# EAGLE design LCD_TFT-Xplained_V1 (EAGLE 9.6.2)
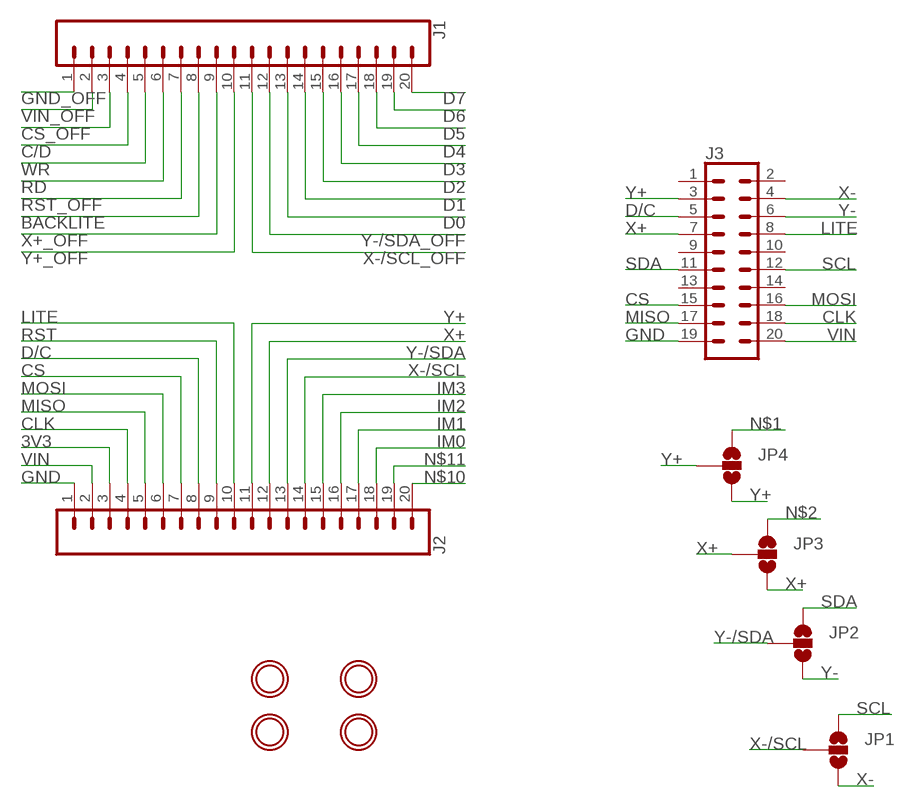
[diagram p0: schematic, sheet 1]

## Parts
J1  CONN_20NOSILK  [1X20_NOSILK]
J2  CONN_20NOSILK  [1X20_NOSILK]
J3  CONN_10X2  [2X10]
JP1  JUMPER-SMT_3_NO_NO-SILK  [SMT-JUMPER_3_NO_NO-SILK]
JP2  JUMPER-SMT_3_NO_NO-SILK  [SMT-JUMPER_3_NO_NO-SILK]
JP3  JUMPER-SMT_3_NO_NO-SILK  [SMT-JUMPER_3_NO_NO-SILK]
JP4  JUMPER-SMT_3_NO_NO-SILK  [SMT-JUMPER_3_NO_NO-SILK]
U$1  MOUNTINGHOLE3.0THIN  [MOUNTINGHOLE_3.0_PLATEDTHIN]
U$2  MOUNTINGHOLE3.0THIN  [MOUNTINGHOLE_3.0_PLATEDTHIN]
U$3  MOUNTINGHOLE3.0THIN  [MOUNTINGHOLE_3.0_PLATEDTHIN]
U$4  MOUNTINGHOLE3.0THIN  [MOUNTINGHOLE_3.0_PLATEDTHIN]

## Nets
3V3: J2.3
BACKLITE: J1.8
C/D: J1.4
CLK: J2.4 J3.18
CS: J2.7 J3.15
CS_OFF: J1.3
D0: J1.13
D1: J1.14
D2: J1.15
D3: J1.16
D4: J1.17
D5: J1.18
D6: J1.19
D7: J1.20
D/C: J2.8 J3.5
GND: J2.1 J3.19
GND_OFF: J1.1
IM0: J2.18
IM1: J2.17
IM2: J2.16
IM3: J2.15
LITE: J2.10 J3.8
MISO: J2.5 J3.17
MOSI: J2.6 J3.16
N$1: JP4.1
N$2: JP3.1
N$10: J2.20
N$11: J2.19
RD: J1.6
RST: J2.9
RST_OFF: J1.7
SCL: J3.12 JP1.1
SDA: J3.11 JP2.1
VIN: J2.2 J3.20
VIN_OFF: J1.2
WR: J1.5
X+: J2.12 J3.7 JP3.2 JP3.3
X+_OFF: J1.9
X-: J3.4 JP1.3
X-/SCL: J2.14 JP1.2
X-/SCL_OFF: J1.11
Y+: J2.11 J3.3 JP4.2 JP4.3
Y+_OFF: J1.10
Y-: J3.6 JP2.3
Y-/SDA: J2.13 JP2.2
Y-/SDA_OFF: J1.12
Unconnected: J3.1 J3.2 J3.9 J3.10 J3.13 J3.14

## Library data of the parts
J1 J2 = SparkFun-Connectors:CONN_20: Multi connection point. Often used as Generic Header-pin footprint for 0.1 inch spaced/style header connections On any of the 0.1 inch spaced packages, you can populate with these: Break Away Headers - Straight <https://www.sparkfun.com/products/116> (PRT-00116) Break Away Male Headers - Right Angle <https://www.sparkfun.com/products/553> (PRT-00553) Female Headers <https://www.sparkfun.com/products/115> (PRT-00115) Break Away Headers - Machine Pin <https://www.sparkfun.com/products/117> (PRT-00117) Break Away Female Headers - Swiss Machine Pin <https://www.sparkfun.com/products/743> (PRT-00743) For SCREWTERMINALS and SPRING TERMINALS visit here: Screw Terimnals on SparkFun.com <https://www.sparkfun.com/search/results?term=Screw+Terminals> (5mm/3.5mm/2.54mm spacing) This device is also useful as a general connection point to wire up your design to another part of your project. Our various solder wires solder well into these plated through hole pads. Hook-Up Wire - Assortment (Stranded, 22 AWG) <https://www.sparkfun.com/products/11375> (PRT-11375) Hook-Up Wire - Assortment (Solid Core, 22 AWG) <https://www.sparkfun.com/products/11367> (PRT-11367) View the entire wire category on our website here <https://www.sparkfun.com/categories/141> Special notes: Molex polarized connector foot print use with SKU : PRT-08231 with associated crimp pins and housings. 1MM SMD Version SKU: PRT-10208 NOTES ON THE VARIANTS LOCK and LOCK_LONGPADS... This footprint was designed to help hold the alignment of a through-hole component (i.e. 6-pin header) while soldering it into place. You may notice that each hole has been shifted either up or down by 0.005 of an inch from it's more standard position (which is a perfectly straight line). This slight alteration caused the pins (the squares in the middle) to touch the edges of the holes. Because they are alternating, it causes a "brace" to hold the component in place. 0.005 has proven to be the perfect amount of "off-center" position when using our standard breakaway headers. Although looks a little odd when you look at the bare footprint, once you have a header in there, the alteration is very hard to notice. Also,if you push a header all the way into place, it is covered up entirely on the bottom side. Note about LOCK SPECIAL package: This is just like the LOCK variant in that the holes are staggared by 5 mil, but except for the last two holes. They are not altered from the "standard" footprint layout. This is used for a special purpose on the layout of our Graphic LCD Backpack. Make sure you want to use this device before selecting it for you project!
J3 = SparkFun-Connectors:CONN_10X2: Multi connection point. Often used as Generic Header-pin footprint for 0.1 inch spaced/style header connections On any of the 0.1 inch spaced packages, you can populate with these: Break Away Headers - Straight <https://www.sparkfun.com/products/116> (PRT-00116) Break Away Male Headers - Right Angle <https://www.sparkfun.com/products/553> (PRT-00553) Female Headers <https://www.sparkfun.com/products/115> (PRT-00115) Break Away Headers - Machine Pin <https://www.sparkfun.com/products/117> (PRT-00117) Break Away Female Headers - Swiss Machine Pin <https://www.sparkfun.com/products/743> (PRT-00743) Special note about the "SPECIAL" package: This was SPECIALLY designed to be used with our Graphic LCD Backpack. Be sure you want to use this! It is not only staggered on each line of header holes, but IT IS ALSO offset of the center point of the top and bottom lines by 5 mil. This causes the headers to lock into place on the "standard" footprint on the LCD screen. The extra squares on the tdocu layer are there simply to reference other pins (if you were to actually populate a longer header than ten long - this is what we do with the backpacks).
JP1-JP4 = SparkFun-Jumpers:JUMPER-SMT_3_NO: Normally open jumper This jumper has three pads in close proximity to each other. Apply solder to close the connection(s).
U$1-U$4 = microbuilder:MOUNTINGHOLE: Mounting Hole For #2 screws (0.086"/2.18mm width, 0.094"/2.4mm hole) use 2.5mm; BOM: EXCLUDE

## Net classes
0 default: width 0.508 mm, drill 0.457 mm, clearance 0.178 mm

## Board
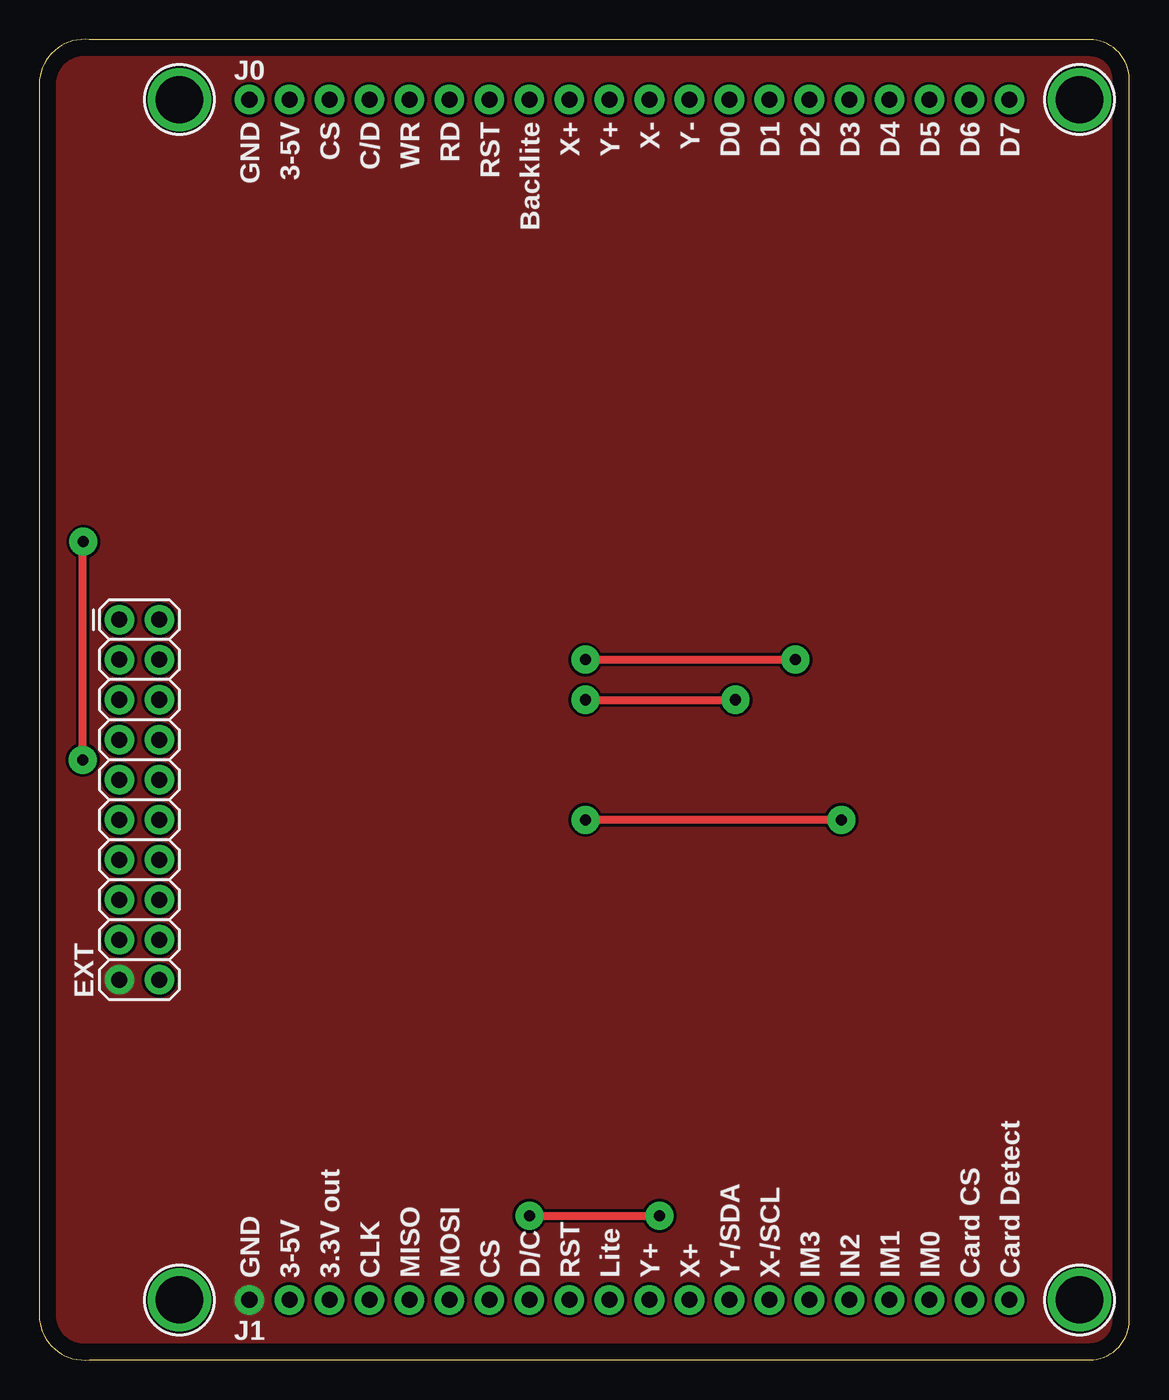
[diagram p1: board, top side]
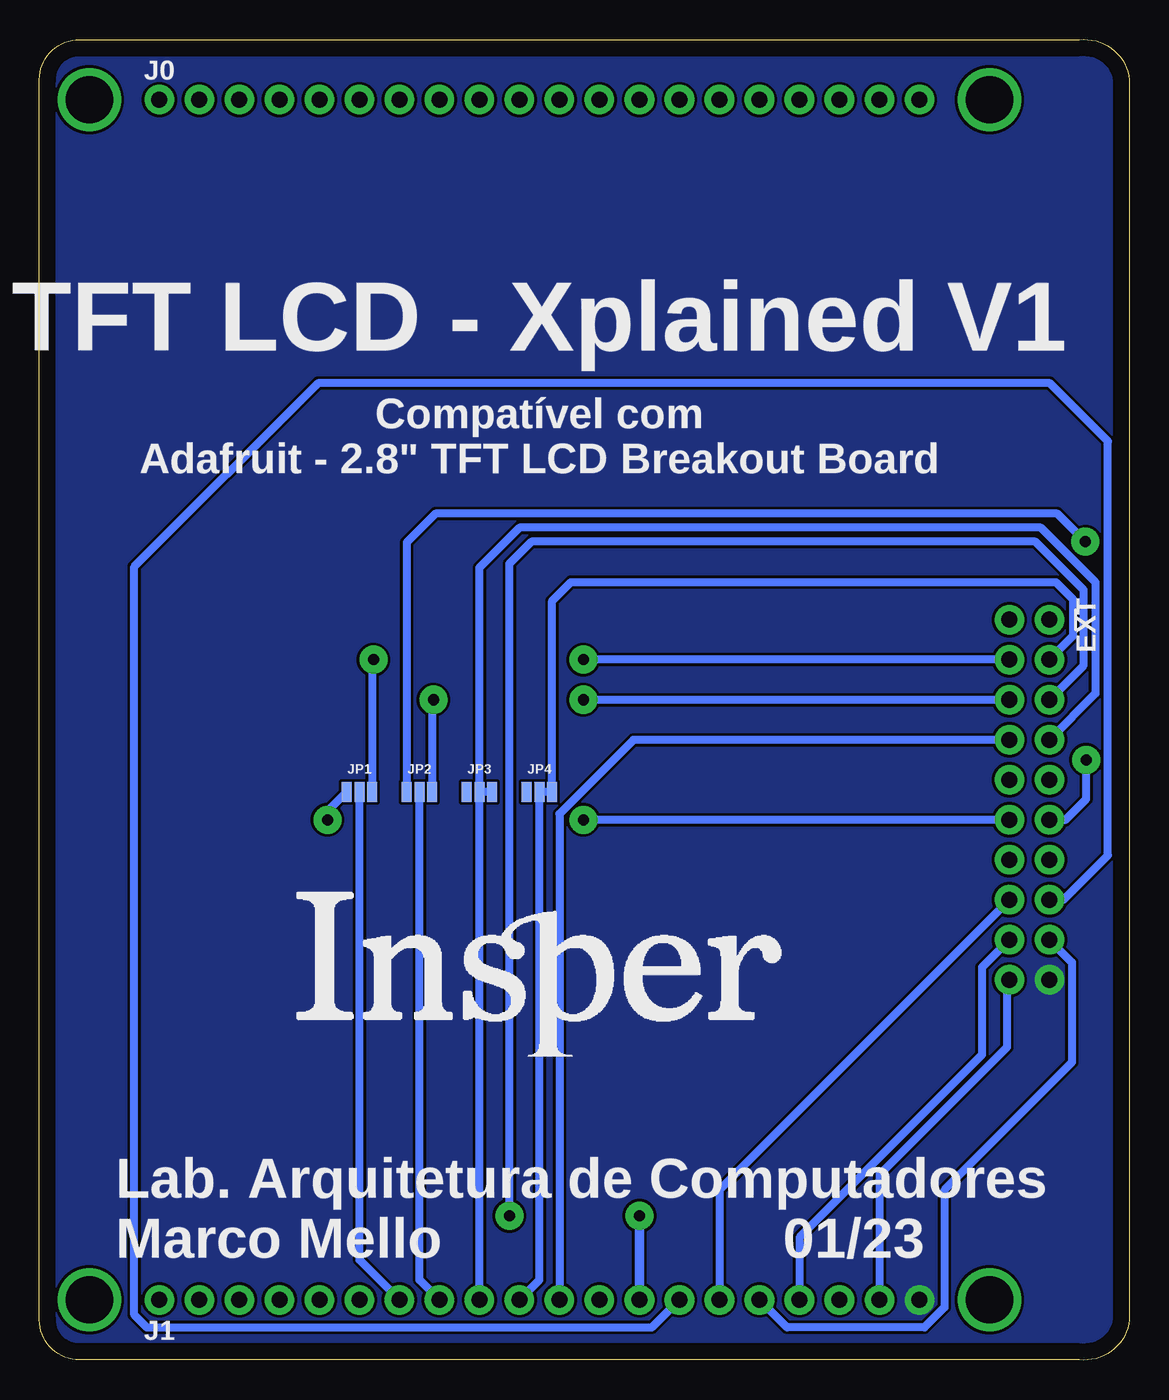
[diagram p2: board, bottom side, seen from below]

Size 69.22 x 83.85 mm. Coordinates in mm from the lower left corner, seen from the top.
Outline: 3.17,0.02 66.67,0.02 arc90 69.22,2.56 69.22,81.3 arc90 66.67,83.84 3.17,83.84 arc90 0,81.3 0,2.56 arc90 3.17,0.02
Copper layers (1*16): Top 0.035mm / dielectric 1.5mm / Bottom 0.035mm
Design rules "default": minimum track width 6mil, minimum drill 0.35mm, track to track 6mil, track to pad 6mil, pad to pad 6mil, via to via 6mil, smd to smd 6mil, copper to edge 40mil, drill to drill 6mil, minimum pad ring 10mil, minimum via ring 8mil, stop-mask expansion 4mil, vias tented up to drill 0mil, thermal gap 10mil

### Footprints (pad centres in the part's own frame; a part is rotated, then mirrored left to right if it is on the bottom)
1X20_NOSILK = drill 1.016 pad 1.88: 1 0,0; 2 2.54,0; 3 5.08,0; 4 7.62,0; 5 10.16,0; 6 12.7,0; 7 15.24,0; 8 17.78,0; 9 20.32,0; 10 22.86,0; 11 25.4,0; 12 27.94,0; 13 30.48,0; 14 33.02,0; 15 35.56,0; 16 38.1,0; 17 40.64,0; 18 43.18,0; 19 45.72,0; 20 48.26,0
2X10 = drill 1.016 pad 1.88: 1 0,0; 2 0,2.54; 3 2.54,0; 4 2.54,2.54; 5 5.08,0; 6 5.08,2.54; 7 7.62,0; 8 7.62,2.54; 9 10.16,0; 10 10.16,2.54; 11 12.7,0; 12 12.7,2.54; 13 15.24,0; 14 15.24,2.54; 15 17.78,0; 16 17.78,2.54; 17 20.32,0; 18 20.32,2.54; 19 22.86,0; 20 22.86,2.54
SMT-JUMPER_3_NO_NO-SILK = smd 0.635 x 1.27: 1 -0.813,0; 2 0,0; 3 0.813,0
MOUNTINGHOLE_3.0_PLATEDTHIN = drill 3 pad 3.6: P$1 0,0

### Placement (x,y rotation side)
J1  13.34,80.03 0 top
J2  13.34,3.83 0 top
J3  5.08,47.01 270 top
JP1  48.9,36.09 0 bottom
JP2  45.09,36.09 0 bottom
JP3  41.27,36.09 0 bottom
JP4  37.47,36.09 0 bottom
U$1  8.89,80.03 0 top
U$2  66.04,80.03 0 top
U$3  8.89,3.83 0 top
U$4  66.04,3.83 0 top

### Tracks (layer width: path | path; a pad name or v marks a point on that pad's centre or on a via)
CLK
  Bottom 0.508: J2.4 20.95,7.8 9.37,19.38 9.37,24.94 J3.18
CS
  Bottom 0.508: J2.7 30.32,2.08 62.39,2.08 63.18,2.87 63.18,50.37 51.53,62.03 5.05,62.03 1.36,58.34 1.36,32.05 4.19,29.23 J3.15
D/C  (via drill 0.7 pad 1.78)
  Top 0.508: v31.11,9.16 v39.37,9.16
  Bottom 0.508: v39.37,9.16 39.37,50.56 37.97,51.96 5.97,51.96 2.9,48.89 2.9,44.11 J3.5
  Bottom 0.61: J2.8 v31.11,9.16
GND
  pour Bottom (no thermals): 0,0.02 69.22,0.02 69.22,83.84 0,83.84
  pour Top (no thermals): 0,0.02 69.22,0.02 69.22,83.84 0,83.84
LITE
  Bottom 0.508: J2.10 36.2,34.69 31.5,39.39 J3.8
MISO
  Bottom 0.508: J2.5 21.75,2.08 13.02,2.08 11.75,3.35 11.75,10.81 3.65,18.91 3.65,25.26 J3.17
MOSI
  Bottom 0.508: J2.6 26.04,10.81 J3.16
SCL  (via drill 0.7 pad 1.78)
  Top 0.508: v50.93,34.31 v34.67,34.31
  Bottom 0.508: JP1.1 50.93,34.87 v50.93,34.31 | J3.12 v34.67,34.31
SDA  (via drill 0.7 pad 1.78)
  Top 0.508: v2.75,38.12 2.75,51.92 v2.79,51.96
  Bottom 0.508: JP2.1 45.9,51.91 44.07,53.74 4.57,53.74 v2.79,51.96 | J3.11 4.06,34.31 2.75,35.62 v2.75,38.12
VIN
  Bottom 0.508: J2.2 15.88,11.77 7.78,19.86 7.78,23.99 J3.20
X+
  Bottom 0.508: J3.7 2.16,42.31 2.16,49.39 5.62,52.85 38.73,52.85 41.27,50.31 JP3.2 | J2.12 JP3.2 | JP3.3 JP3.2
X-  (via drill 0.7 pad 1.78)
  Top 0.508: v34.67,44.47 v48.01,44.47
  Bottom 0.508: v48.01,44.47 48.08,44.39 JP1.3 | J3.4 v34.67,44.47
X-/SCL
  Bottom 0.508: JP1.2 48.9,6.37 J2.14
Y+
  Bottom 0.508: J2.11 37.47,5.1 JP4.2 JP4.3 36.65,48.2 35.47,49.39 4.67,49.39 3.59,48.31 3.59,45.96 J3.3
Y-  (via drill 0.7 pad 1.78)
  Top 0.508: v34.67,41.93 v44.2,41.93
  Bottom 0.508: J3.6 v34.67,41.93 | v44.2,41.93 44.27,41.85 JP2.3
Y-/SDA
  Bottom 0.508: JP2.2 45.09,5.1 J2.13

### Text on the board
tPlace: J0 | GND | 3-5V | CS | C/D | WR | RD | RST | Backlite | X+ | Y+ | X- | Y- | D0 | D1 | D2 | D3 | D4 | D5 | D6 | D7 | EXT | GND | 3-5V | 3.3V out | CLK | MISO | MOSI | CS | D/C | RST | Lite | Y+ | X+ | Y-/SDA | X-/SCL | IM3 | IN2 | IM1 | IM0 | Card CS | Card Detect | J1
bPlace: J0 | TFT LCD - Xplained V1 | Compatível com / Adafruit - 2.8" TFT LCD Breakout Board | EXT | Lab. Arquitetura de Computadores / Marco Mello 01/23 | J1